# EAGLE design collection (EAGLE 5.10)
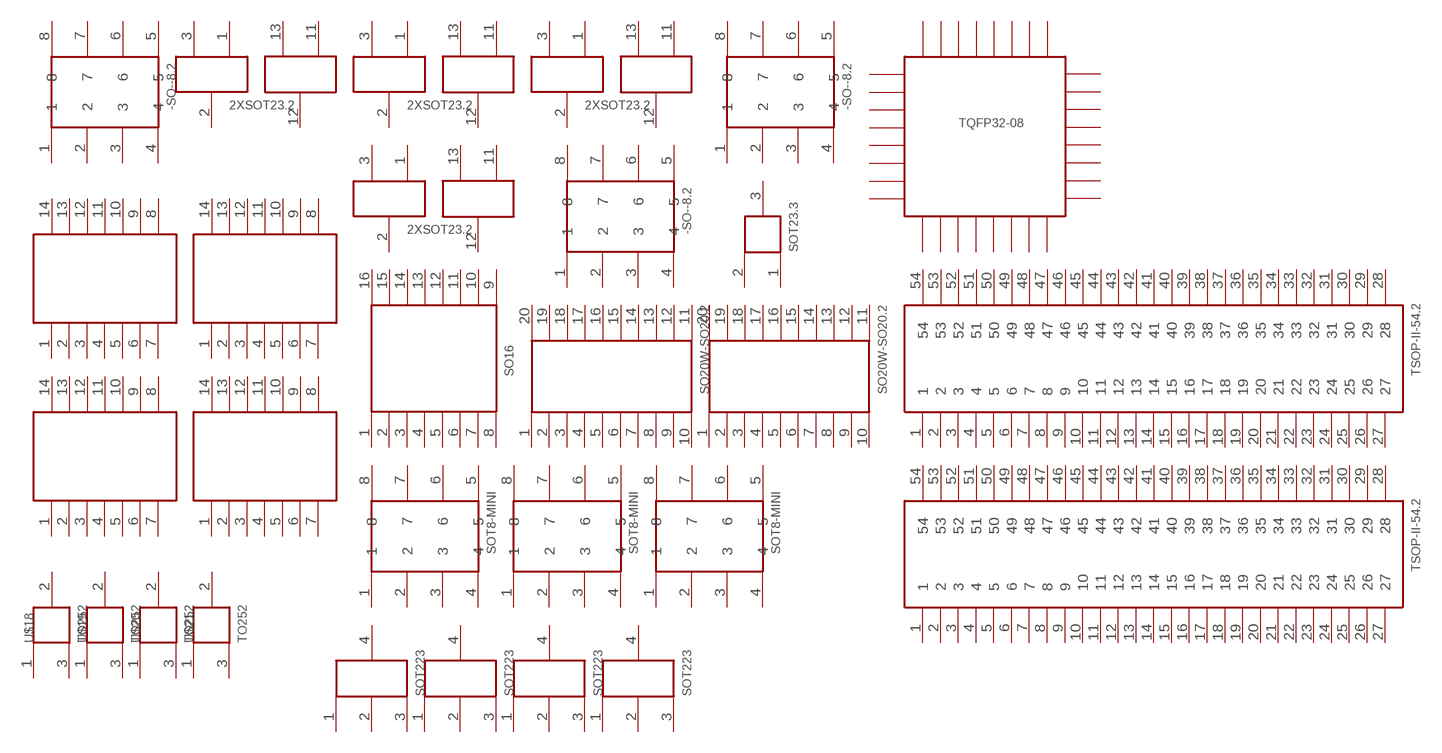
[diagram p0: schematic, sheet 1]

## Parts
U$1  -SO--8.2  [-SO--08.2]
U$2  2XSOT23.2  [SOT23.5]
U$3  SO14-MINI  [SO14-MINI]
U$4  SO14-MINI  [SO14-MINI]
U$5  SO14-MINI  [SO14-MINI]
U$6  SO14-MINI  [SO14-MINI]
U$7  2XSOT23.2  [SOT23.5]
U$8  2XSOT23.2  [SOT23.5]
U$9  2XSOT23.2  [SOT23.5]
U$10  -SO--8.2  [-SO--08.2]
U$11  -SO--8.2  [-SO--08.2]
U$12  SO16  [SO16.V2]
U$13  SO20W-SO20.2  [SO20W-SO20.2]
U$14  SO20W-SO20.2  [SO20W-SO20.2]
U$15  SOT8-MINI  [SO08-MINI]
U$16  SOT8-MINI  [SO08-MINI]
U$17  SOT8-MINI  [SO08-MINI]
U$18  TO252  [TO252]
U$19  TO252  [TO252]
U$20  TO252  [TO252]
U$21  TO252  [TO252]
U$23  TQFP32-08  [TQFP32-08]
U$24  TSOP-II-54.2  [TSOP-II-54.2]
U$25  TSOP-II-54.2  [TSOP-II-54.2]
U$26  SOT223  [SOT223]
U$27  SOT223  [SOT223]
U$28  SOT223  [SOT223]
U$29  SOT223  [SOT223]
U$30  SOT23.3  [SOT23.3]
Unconnected: U$1.1 U$1.2 U$1.3 U$1.4 U$1.5 U$1.6 U$1.7 U$1.8 U$2.1 U$2.2 U$2.3 U$2.11 U$2.12 U$2.13 U$3.1 U$3.2 U$3.3 U$3.4 U$3.5 U$3.6 U$3.7 U$3.8 U$3.9 U$3.10 U$3.11 U$3.12 U$3.13 U$3.14 U$4.1 U$4.2 U$4.3 U$4.4 U$4.5 U$4.6 U$4.7 U$4.8 U$4.9 U$4.10 U$4.11 U$4.12 U$4.13 U$4.14 U$5.1 U$5.2 U$5.3 U$5.4 U$5.5 U$5.6 U$5.7 U$5.8 U$5.9 U$5.10 U$5.11 U$5.12 U$5.13 U$5.14 U$6.1 U$6.2 U$6.3 U$6.4 U$6.5 U$6.6 U$6.7 U$6.8 U$6.9 U$6.10 U$6.11 U$6.12 U$6.13 U$6.14 U$7.1 U$7.2 U$7.3 U$7.11 U$7.12 U$7.13 U$8.1 U$8.2 U$8.3 U$8.11 U$8.12 U$8.13 U$9.1 U$9.2 U$9.3 U$9.11 U$9.12 U$9.13 U$10.1 U$10.2 U$10.3 U$10.4 U$10.5 U$10.6 U$10.7 U$10.8 U$11.1 U$11.2 U$11.3 U$11.4 U$11.5 U$11.6 U$11.7 U$11.8 U$12.1 U$12.2 U$12.3 U$12.4 U$12.5 U$12.6 U$12.7 U$12.8 U$12.9 U$12.10 U$12.11 U$12.12 U$12.13 U$12.14 U$12.15 U$12.16 U$13.1 U$13.2 U$13.3 U$13.4 U$13.5 U$13.6 U$13.7 U$13.8 U$13.9 U$13.10 U$13.11 U$13.12 U$13.13 U$13.14 U$13.15 U$13.16 U$13.17 U$13.18 U$13.19 U$13.20 U$14.1 U$14.2 U$14.3 U$14.4 U$14.5 U$14.6 U$14.7 U$14.8 U$14.9 U$14.10 U$14.11 U$14.12 U$14.13 U$14.14 U$14.15 U$14.16 U$14.17 U$14.18 U$14.19 U$14.20 U$15.1 U$15.2 U$15.3 U$15.4 U$15.5 U$15.6 U$15.7 U$15.8 U$16.1 U$16.2 U$16.3 U$16.4 U$16.5 U$16.6 U$16.7 U$16.8 U$17.1 U$17.2 U$17.3 U$17.4 U$17.5 U$17.6 U$17.7 U$17.8 U$18.1 U$18.2 U$18.3 U$19.1 U$19.2 U$19.3 U$20.1 U$20.2 U$20.3 U$21.1 U$21.2 U$21.3 U$23.001 U$23.002 U$23.003 U$23.004 U$23.005 U$23.006 U$23.007 U$23.008 U$23.009 U$23.010 U$23.011 U$23.012 U$23.013 U$23.014 U$23.015 U$23.016 U$23.017 U$23.018 U$23.019 U$23.020 U$23.021 U$23.022 U$23.023 U$23.024 U$23.025 U$23.026 U$23.027 U$23.028 U$23.029 U$23.030 U$23.031 U$23.032 U$24.1 U$24.2 U$24.3 U$24.4 U$24.5 U$24.6 U$24.7 U$24.8 U$24.9 U$24.10 U$24.11 U$24.12 U$24.13 U$24.14 U$24.15 U$24.16 U$24.17 U$24.18 U$24.19 U$24.20 U$24.21 U$24.22 U$24.23 U$24.24 U$24.25 U$24.26 U$24.27 U$24.28 U$24.29 U$24.30 U$24.31 U$24.32 U$24.33 U$24.34 U$24.35 U$24.36 U$24.37 U$24.38 U$24.39 U$24.40 U$24.41 U$24.42 U$24.43 U$24.44 U$24.45 U$24.46 U$24.47 U$24.48 U$24.49 U$24.50 U$24.51 U$24.52 U$24.53 U$24.54 U$25.1 U$25.2 U$25.3 U$25.4 U$25.5 U$25.6 U$25.7 U$25.8 U$25.9 U$25.10 U$25.11 U$25.12 U$25.13 U$25.14 U$25.15 U$25.16 U$25.17 U$25.18 U$25.19 U$25.20 U$25.21 U$25.22 U$25.23 U$25.24 U$25.25 U$25.26 U$25.27 U$25.28 U$25.29 U$25.30 U$25.31 U$25.32 U$25.33 U$25.34 U$25.35 U$25.36 U$25.37 U$25.38 U$25.39 U$25.40 U$25.41 U$25.42 U$25.43 U$25.44 U$25.45 U$25.46 U$25.47 U$25.48 U$25.49 U$25.50 U$25.51 U$25.52 U$25.53 U$25.54 U$26.1 U$26.2 U$26.3 U$26.4 U$27.1 U$27.2 U$27.3 U$27.4 U$28.1 U$28.2 U$28.3 U$28.4 U$29.1 U$29.2 U$29.3 U$29.4 U$30.1(A1) U$30.2(A2) U$30.3(A3)

## Library data of the parts
U$1 U$10 U$11 = smd-adapter:-SO--8.2
U$2 U$7-U$9 = smd-adapter:2XSOT23.2
U$3-U$6 = smd-adapter:SO14-MINI
U$12 = smd-adapter:SO16
U$13 U$14 = smd-adapter:SO20W-SO20.2
U$15-U$17 = smd-adapter:SOT8-MINI: Auf die Pinbelegung achten und smd zuerst löten!
U$18-U$21 = smd-adapter:TO252
U$23 = smd-adapter:TQFP32-08
U$24 U$25 = smd-adapter:TSOP-II-54.2
U$26-U$29 = smd-adapter:SOT223
U$30 = smd-adapter:SOT23.3

## Board
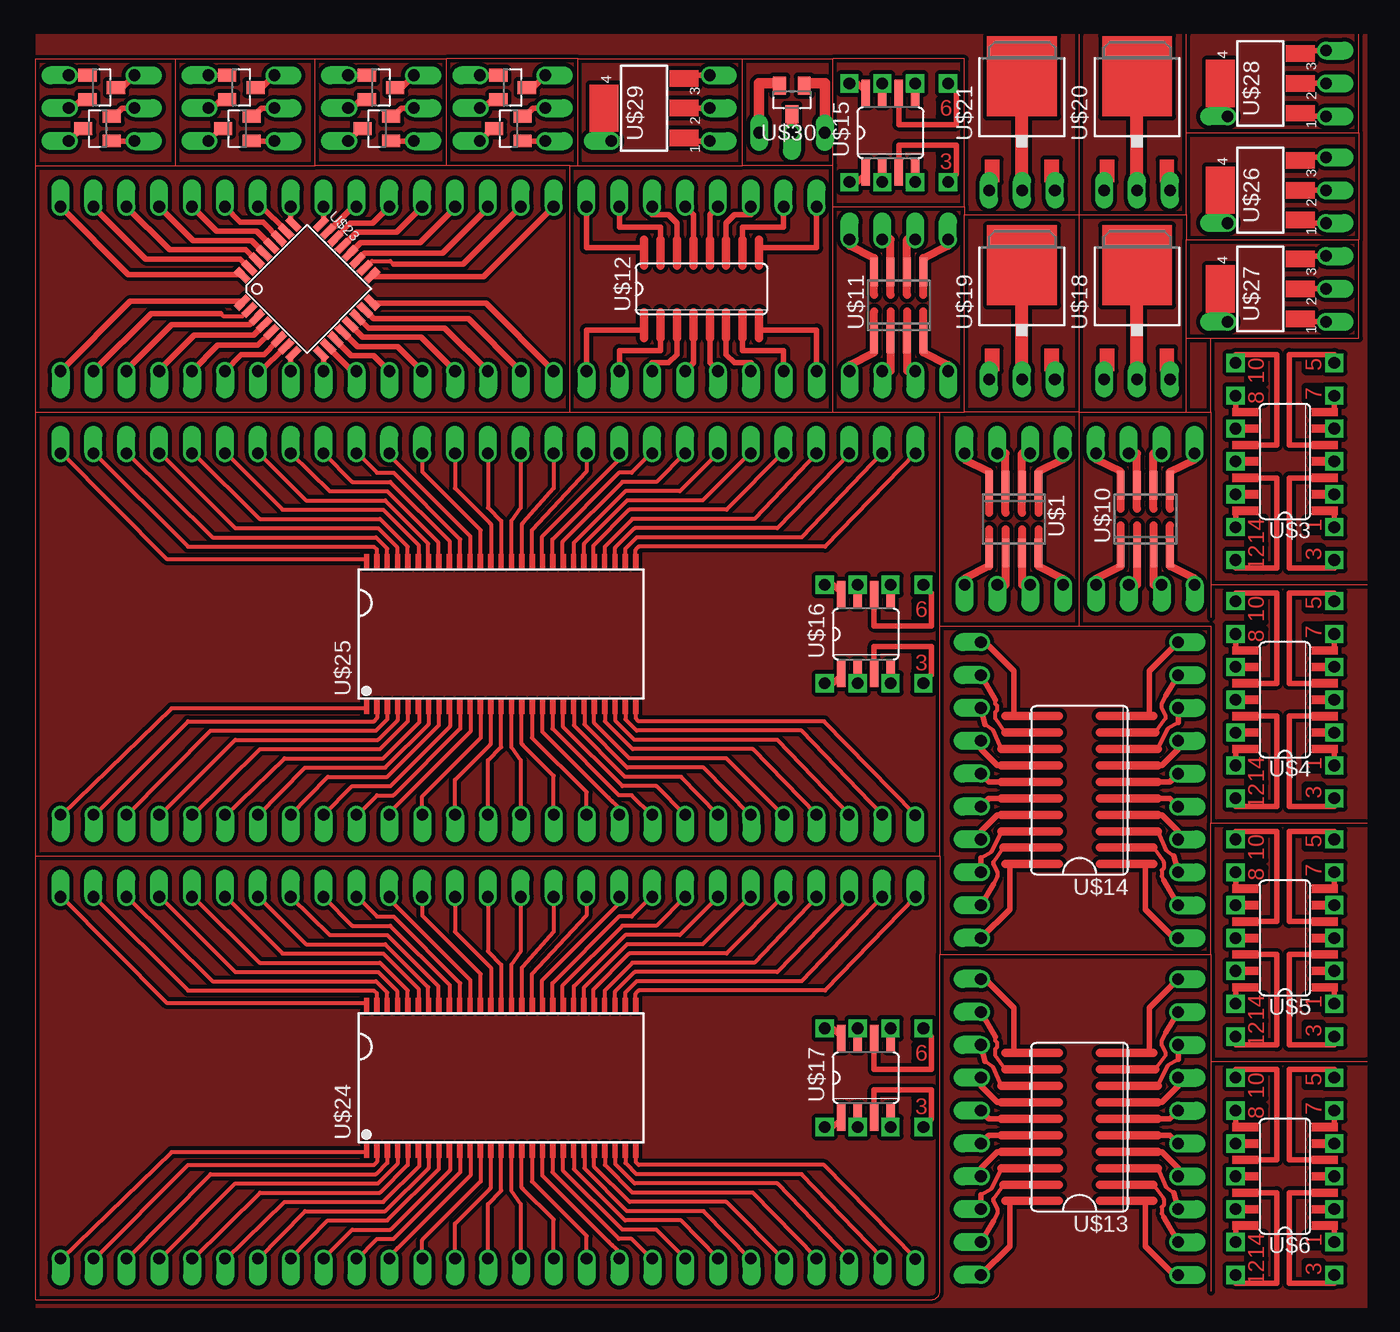
[diagram p1: board, top side]

No outline drawn. Coordinates in mm, seen from the top.
Copper layers (1*16): Top 0.035mm / dielectric 1.5mm / Bottom 0.035mm
Design rules "default": minimum track width 10mil, minimum drill 24mil, track to track 8mil, track to pad 8mil, pad to pad 8mil, via to via 8mil, smd to smd 8mil, copper to edge 40mil, drill to drill 8mil, minimum pad ring 10mil, minimum via ring 8mil, stop-mask expansion 4mil, vias tented up to drill 0mil, thermal gap 10mil

### Footprints (pad centres in the part's own frame; a part is rotated, then mirrored left to right if it is on the bottom)
-SO--08.2 = drill 0.9 pad 1.27 offset: 1 -3.81,-5.08; 2 -1.27,-5.08; 3 1.27,-5.08; 4 3.81,-5.08; 5 3.81,5.08; 6 1.27,5.08; 7 -1.27,5.08; 8 -3.81,5.08 | smd 0.6 x 2.2: NC1 -1.905,-2.6; NC2 -0.635,-2.6; NC3 0.635,-2.6; NC4 1.905,-2.6; NC5 1.905,2.6; NC6 0.635,2.6; NC7 -0.635,2.6; NC8 -1.905,2.6
SOT23.5 = drill 0.9 offset: 1 -2.54,-2.54; 2 -2.54,2.54; 3 0,-2.54; 11 2.54,2.54; 12 2.54,-2.54; 13 0,2.54 | smd 1 x 1.4: NC6 -1.587,1.417; NC7 -0.637,-0.782; NC8 -2.538,-0.782; NC9 1.587,-1.1; NC10 0.637,1.1; NC11 2.538,1.1
SO14-MINI = drill 0.9 square: 1 -5.08,-2.54; 3 -7.62,-2.54; 5 7.62,-2.54; 7 5.08,-2.54; 8 5.08,5.08; 10 7.62,5.08; 12 -7.62,5.08; 14 -5.08,5.08 | drill 0.9 pad 1.27 square: 2 -2.54,-2.54; 4 0,-2.54; 6 2.54,-2.54; 9 2.54,5.08; 11 0,5.08; 13 -2.54,5.08
SO16.V2 = drill 0.9 offset: 1 -7.62,-5.08; 2 -5.08,-5.08; 3 -2.54,-5.08; 4 0,-5.08; 5 2.54,-5.08; 6 5.08,-5.08; 7 7.62,-5.08; 8 10.16,-5.08; 9 10.16,7.62; 10 7.62,7.62; 11 5.08,7.62; 12 2.54,7.62; 13 0,7.62; 14 -2.54,7.62; 15 -5.08,7.62; 16 -7.62,7.62
SO20W-SO20.2 = drill 0.9 offset: 1 -12.7,-7.62; 2 -10.16,-7.62; 3 -7.62,-7.62; 4 -5.08,-7.62; 5 -2.54,-7.62; 6 0,-7.62; 7 2.54,-7.62; 8 5.08,-7.62; 9 7.62,-7.62; 10 10.16,-7.62; 11 10.16,7.62; 12 7.62,7.62; 13 5.08,7.62; 14 2.54,7.62; 15 0,7.62; 16 -2.54,7.62; 17 -5.08,7.62; 18 -7.62,7.62; 19 -10.16,7.62; 20 -12.7,7.62
SO08-MINI = drill 0.9 square: 1 -2.54,-2.54; 3 5.08,-2.54; 6 5.08,5.08; 8 -2.54,5.08 | drill 0.9 pad 1.35 square: 2 0,-2.54; 4 2.54,-2.54; 5 2.54,5.08; 7 0,5.08 | smd 0.66 x 2.032: NC1 -1.27,-1.803; NC2 0,-1.803; NC3 1.27,-1.803; NC4 2.54,-1.803; NC5 2.54,4.343; NC6 1.27,4.343; NC7 0,4.343; NC8 -1.27,4.343
TO252 = drill 0.9 long: 1 -2.54,-7.62; 2 0,-7.62; 3 2.54,-7.62
TQFP32-08 = smd 1.27 x 0.559 rotated 315: 1 -2.325,8.825; 2 -2.891,8.259; 3 -3.457,7.694; 4 -4.022,7.128; 5 -4.588,6.562; 6 -5.154,5.997; 7 -5.72,5.431; 8 -6.285,4.865; 17 -0.215,-1.205; 18 0.351,-0.639; 19 0.917,-0.074; 20 1.482,0.492; 21 2.048,1.058; 22 2.614,1.623; 23 3.179,2.189; 24 3.745,2.755 | drill 0.9 offset: 001 -20.32,-2.54; 002 -17.78,-2.54; 003 -15.24,-2.54; 004 -12.7,-2.54; 005 -10.16,-2.54; 006 -7.62,-2.54; 007 -5.08,-2.54; 008 -2.54,-2.54; 009 0,-2.54; 010 2.54,-2.54; 011 5.08,-2.54; 012 7.62,-2.54; 013 10.16,-2.54; 014 12.7,-2.54; 015 15.24,-2.54; 016 17.78,-2.54; 017 17.78,10.16; 018 15.24,10.16; 019 12.7,10.16; 020 10.16,10.16; 021 7.62,10.16; 022 5.08,10.16; 023 2.54,10.16; 024 0,10.16; 025 -2.54,10.16; 026 -5.08,10.16; 027 -7.62,10.16; 028 -10.16,10.16; 029 -12.7,10.16; 030 -15.24,10.16; 031 -17.78,10.16; 032 -20.32,10.16 | smd 0.559 x 1.27 rotated 315: 9 -6.285,2.755; 10 -5.72,2.189; 11 -5.154,1.623; 12 -4.588,1.058; 13 -4.022,0.492; 14 -3.457,-0.074; 15 -2.891,-0.639; 16 -2.325,-1.205; 25 3.745,4.865; 26 3.179,5.431; 27 2.614,5.997; 28 2.048,6.562; 29 1.482,7.128; 30 0.917,7.694; 31 0.351,8.259; 32 -0.215,8.825
TSOP-II-54.2 = drill 0.9 offset: 1 -33.015,-15.24; 2 -30.475,-15.24; 3 -27.935,-15.24; 4 -25.395,-15.24; 5 -22.855,-15.24; 6 -20.315,-15.24; 7 -17.775,-15.24; 8 -15.235,-15.24; 9 -12.695,-15.24; 10 -10.155,-15.24; 11 -7.615,-15.24; 12 -5.075,-15.24; 13 -2.535,-15.24; 14 0.005,-15.24; 15 2.545,-15.24; 16 5.085,-15.24; 17 7.625,-15.24; 18 10.165,-15.24; 19 12.705,-15.24; 20 15.245,-15.24; 21 17.785,-15.24; 22 20.325,-15.24; 23 22.865,-15.24; 24 25.39,-15.24; 25 27.89,-15.24; 26 30.47,-15.24; 27 33.01,-15.28; 28 33.045,12.7; 29 30.465,12.7; 30 27.925,12.7; 31 25.385,12.7; 32 22.86,12.7; 33 20.32,12.7; 34 17.78,12.7; 35 15.24,12.7; 36 12.7,12.7; 37 10.16,12.7; 38 7.62,12.7; 39 5.08,12.7; 40 2.54,12.7; 41 0,12.7; 42 -2.54,12.7; 43 -5.08,12.7; 44 -7.62,12.7; 45 -10.16,12.7; 46 -12.7,12.7; 47 -15.24,12.7; 48 -17.78,12.7; 49 -20.32,12.7; 50 -22.86,12.7; 51 -25.4,12.7; 52 -27.94,12.7; 53 -30.48,12.7; 54 -33.02,12.7
SOT223 = drill 0.9 offset: 1 -2.54,-5.08; 2 0,-5.08; 3 2.54,-5.08; 4 -2.54,2.54
SOT23.3 = drill 0.9 long: 1 -2.54,0; 2 2.54,0 | drill 0.9 offset: 3 0,0 | smd 1 x 1.4: NC -0.95,-3.64; NC1 0.95,-3.64; NC2 0,-1.44

### Placement (x,y rotation side)
U$1  76.2,60.96 180 top
U$2  5.71,92.71 90 top
U$3  98.42,65.41 90 top
U$4  98.42,46.99 90 top
U$5  98.42,28.57 90 top
U$6  98.42,10.16 90 top
U$7  16.51,92.71 90 top
U$8  27.3,92.71 90 top
U$9  37.47,92.71 90 top
U$10  86.36,60.96 0 top
U$11  67.31,77.47 0 top
U$12  50.8,77.47 0 top
U$13  81.28,15.24 90 top
U$14  81.28,41.27 90 top
U$15  66.04,89.53 0 top
U$16  64.14,50.8 0 top
U$17  64.14,16.51 0 top
U$18  85.72,79.38 0 top
U$19  76.83,79.38 0 top
U$20  85.72,93.98 0 top
U$21  76.83,93.98 0 top
U$23  22.86,74.93 0 top
U$24  35.56,19.05 0 top
U$25  35.56,53.34 0 top
U$26  95.25,86.36 90 top
U$27  95.25,78.74 90 top
U$28  95.25,94.61 90 top
U$29  47.62,92.71 90 top
U$30  59.05,90.81 180 top

### Tracks (layer width: path | path; a pad name or v marks a point on that pad's centre or on a via)
N$2
  pour Top (isolate 0.305): 0.64,98.42 103.5,98.42 103.5,0 0.64,0
N$4
  Top 0: 102.87,82.55 102.87,74.93 91.44,74.93 | 102.87,90.81 102.87,82.55 | 102.87,90.81 102.87,98.42 | 81.28,69.22 81.28,98.42 | 70.48,34.92 70.48,52.7 | 70.48,52.7 70.48,69.22 | 62.23,69.22 70.48,69.22 | 41.91,69.22 62.23,69.22 | 0.64,69.22 41.91,69.22 | 0.64,34.92 0.64,69.22 | 0.64,34.92 70.48,34.92 | 0.64,34.92 0.64,0.64 69.85,0.64 arc90 70.48,1.27 70.48,27.3 | 70.48,34.92 70.48,27.3 | 41.91,69.22 41.91,88.27 | 41.91,88.27 32.38,88.27 | 32.38,88.27 22.23,88.27 | 11.43,88.27 22.23,88.27 | 0.64,88.27 11.43,88.27 | 0.64,69.22 0.64,88.27 | 41.91,88.27 42.55,88.27 | 42.55,88.27 55.24,88.27 | 62.23,88.27 55.24,88.27 | 62.23,85.09 62.23,88.27 | 62.23,69.22 62.23,85.09 | 62.23,85.09 72.39,85.09 | 72.39,69.22 72.39,84.45 | 72.39,85.09 72.39,84.45 | 70.48,69.22 72.39,69.22 | 0.64,88.27 0.64,96.52 11.43,96.52 | 11.43,96.52 22.23,96.52 | 22.23,96.52 32.38,96.52 | 42.55,96.52 32.38,96.52 | 42.55,96.52 55.24,96.52 | 55.24,96.52 62.23,96.52 | 62.23,96.52 72.39,96.52 72.39,85.09 | 62.23,88.27 62.23,96.52 | 55.24,88.27 55.24,96.52 | 42.55,88.27 42.55,96.52 | 32.38,88.27 32.38,96.52 | 22.23,88.27 22.23,96.52 | 11.43,88.27 11.43,96.52 | 72.39,84.45 89.53,84.45 | 81.28,69.22 72.39,69.22 | 81.28,69.22 89.53,69.22 | 89.53,69.22 89.53,74.93 | 89.53,84.45 89.53,82.55 | 89.53,74.93 89.53,82.55 | 89.53,84.45 89.53,90.81 | 89.53,90.81 89.53,98.42 | 89.53,74.93 91.44,74.93 | 89.53,90.81 102.87,90.81 | 89.53,82.55 102.87,82.55 | 81.28,52.7 81.28,69.22 | 70.48,52.7 81.28,52.7 | 81.28,52.7 91.44,52.7 91.44,37.47 | 91.44,27.3 91.44,37.47 | 70.48,27.3 91.44,27.3 | 91.44,27.3 91.44,19.05 | 91.44,19.05 91.44,1.27 | 91.44,19.05 103.5,19.05 | 91.44,37.47 103.5,37.47 | 91.44,55.88 103.5,55.88 | 91.44,55.88 91.44,53.34
  Top 0: 89.53,69.22 91.44,69.22 | 91.44,69.22 91.44,55.88 | 91.44,69.22 91.44,74.93